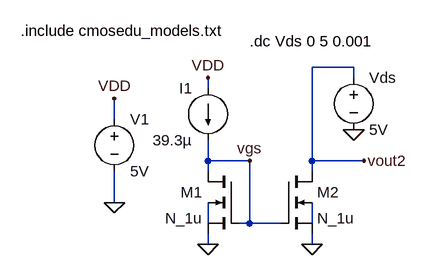
[diagram p0: schematic pt5.asc]
pt5.asc, the LTspice schematic file:
Version 4
SHEET 1 880 680
WIRE 416 -80 352 -80
WIRE 416 -64 416 -80
WIRE 192 -48 192 -64
WIRE 48 0 48 -32
WIRE 192 64 192 32
WIRE 256 64 192 64
WIRE 352 64 352 -80
WIRE 432 64 352 64
WIRE 192 80 192 64
WIRE 352 80 352 64
WIRE 48 128 48 80
WIRE 192 160 192 128
WIRE 256 160 256 64
WIRE 256 160 240 160
WIRE 304 160 256 160
WIRE 352 160 352 128
WIRE 192 192 192 176
WIRE 352 192 352 176
FLAG 48 128 0
FLAG 192 192 0
FLAG 256 64 vgs
FLAG 48 -32 VDD
FLAG 192 -64 VDD
FLAG 352 192 0
FLAG 416 16 0
FLAG 432 64 vout2
SYMBOL voltage 48 -16 R0
WINDOW 123 0 0 Left 2
WINDOW 39 0 0 Left 2
SYMATTR InstName V1
SYMATTR Value 5V
SYMBOL nmos4 240 80 M0
SYMATTR InstName M1
SYMATTR Value N_1u
SYMATTR Value2 l=1.5u w=3u
SYMBOL current 192 -48 M0
WINDOW 123 0 0 Left 2
WINDOW 39 0 0 Left 2
SYMATTR InstName I1
SYMATTR Value 39.3µ
SYMBOL nmos4 304 80 R0
SYMATTR InstName M2
SYMATTR Value N_1u
SYMATTR Value2 l=1.5u w=3u
SYMBOL voltage 416 -80 R0
WINDOW 123 0 0 Left 2
WINDOW 39 0 0 Left 2
SYMATTR InstName Vds
SYMATTR Value 5V
TEXT -96 -136 Left 2 !.include cmosedu_models.txt
TEXT 256 -120 Left 2 !.dc Vds 0 5 0.001

The netlist it stands for:
* pt5.asc
V1 VDD 0 5V
M1 vgs vgs 0 N001 N_1u l=1.5u w=3u
I1 VDD vgs 39.3µ
M2 vout2 vgs 0 N002 N_1u l=1.5u w=3u
Vds vout2 0 5V
.model NMOS NMOS
.model PMOS PMOS
.lib standard.mos
.include cmosedu_models.txt
.dc Vds 0 5 0.001
.backanno
.end